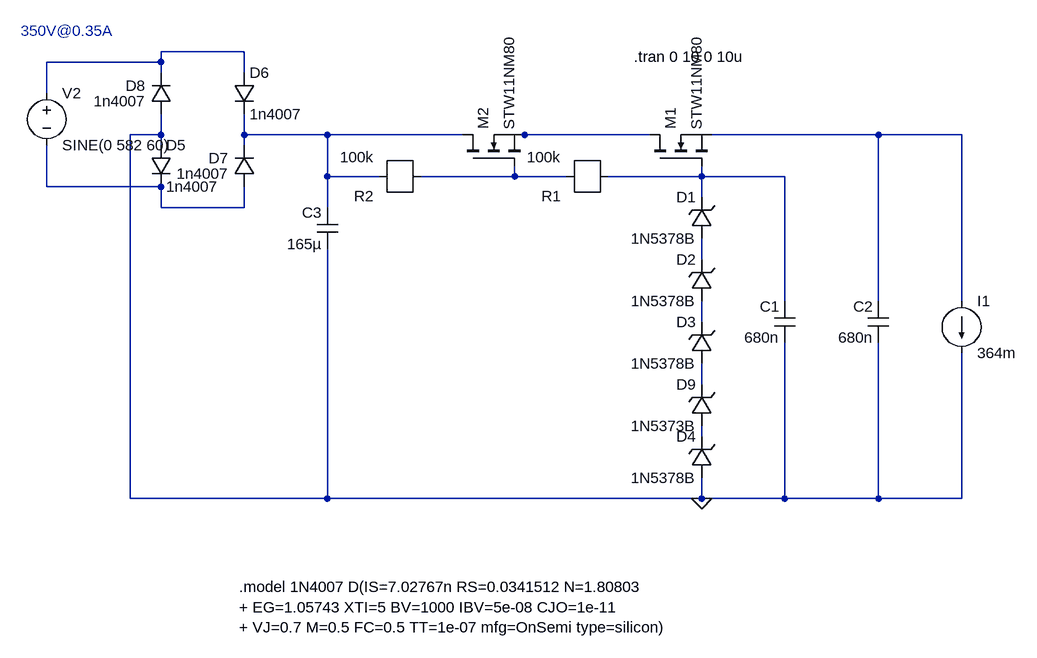
[diagram p0: schematic amp_TCC_fontes_430V_V2.0.asc]
amp_TCC_fontes_430V_V2.0.asc, the LTspice schematic file:
Version 4
SHEET 1 880 964
WIRE -416 80 -544 80
WIRE -544 96 -544 80
WIRE -544 96 -720 96
WIRE -544 112 -544 96
WIRE -416 112 -416 80
WIRE -720 144 -720 96
WIRE -544 208 -544 176
WIRE -544 208 -592 208
WIRE -416 208 -416 176
WIRE -288 208 -416 208
WIRE -80 208 -288 208
WIRE 16 208 0 208
WIRE 208 208 16 208
WIRE 560 208 304 208
WIRE 688 208 560 208
WIRE -544 224 -544 208
WIRE -416 224 -416 208
WIRE -288 272 -288 208
WIRE -208 272 -288 272
WIRE 0 272 0 256
WIRE 0 272 -144 272
WIRE 80 272 0 272
WIRE 288 272 288 256
WIRE 288 272 144 272
WIRE 416 272 288 272
WIRE -720 288 -720 224
WIRE -544 288 -720 288
WIRE 288 304 288 272
WIRE -544 320 -544 288
WIRE -416 320 -416 288
WIRE -416 320 -544 320
WIRE -288 320 -288 272
WIRE 288 400 288 368
WIRE 416 464 416 272
WIRE 560 464 560 208
WIRE 688 464 688 208
WIRE 288 496 288 464
WIRE 288 592 288 560
WIRE 288 672 288 656
WIRE -592 768 -592 208
WIRE -288 768 -288 384
WIRE -288 768 -592 768
WIRE 288 768 288 736
WIRE 288 768 -288 768
WIRE 416 768 416 528
WIRE 416 768 288 768
WIRE 560 768 560 528
WIRE 560 768 416 768
WIRE 688 768 688 544
WIRE 688 768 560 768
FLAG 288 768 0
SYMBOL nmos 208 256 R270
SYMATTR InstName M1
SYMATTR Value STW11NM80
SYMBOL zener 304 464 R180
WINDOW 0 24 64 Left 2
WINDOW 3 24 0 Left 2
SYMATTR InstName D2
SYMATTR Value 1N5378B
SYMBOL zener 304 368 R180
WINDOW 0 24 64 Left 2
WINDOW 3 24 0 Left 2
SYMATTR InstName D1
SYMATTR Value 1N5378B
SYMBOL zener 304 560 R180
WINDOW 0 24 64 Left 2
WINDOW 3 24 0 Left 2
SYMATTR InstName D3
SYMATTR Value 1N5378B
SYMBOL zener 304 736 R180
WINDOW 0 24 64 Left 2
WINDOW 3 24 0 Left 2
SYMATTR InstName D4
SYMATTR Value 1N5378B
SYMBOL r 144 272 R180
SYMATTR InstName R1
SYMATTR Value 100k
SYMBOL cap 432 528 R180
WINDOW 0 24 56 Left 2
WINDOW 3 24 8 Left 2
SYMATTR InstName C1
SYMATTR Value 680n
SYMBOL cap 576 528 R180
WINDOW 0 24 56 Left 2
WINDOW 3 24 8 Left 2
SYMATTR InstName C2
SYMATTR Value 680n
SYMBOL current 688 464 R0
SYMATTR InstName I1
SYMATTR Value 364m
SYMBOL cap -272 384 R180
WINDOW 0 24 56 Left 2
WINDOW 3 24 8 Left 2
SYMATTR InstName C3
SYMATTR Value 165µ
SYMATTR SpiceLine Rser=660m
SYMBOL voltage -720 128 R0
SYMATTR InstName V2
SYMATTR Value SINE(0 582 60)
SYMATTR SpiceLine Rser=49.705
SYMBOL diode -560 224 R0
SYMATTR InstName D5
SYMATTR Value 1n4007
SYMBOL diode -432 112 R0
SYMATTR InstName D6
SYMATTR Value 1n4007
SYMBOL diode -400 288 R180
WINDOW 0 40 44 Left 2
WINDOW 3 39 20 Left 2
SYMATTR InstName D7
SYMATTR Value 1n4007
SYMBOL diode -528 176 R180
WINDOW 0 40 44 Left 2
WINDOW 3 39 20 Left 2
SYMATTR InstName D8
SYMATTR Value 1n4007
SYMBOL zener 304 656 R180
WINDOW 0 24 64 Left 2
WINDOW 3 24 0 Left 2
SYMATTR InstName D9
SYMATTR Value 1N5373B
SYMBOL nmos -80 256 R270
SYMATTR InstName M2
SYMATTR Value STW11NM80
SYMBOL r -144 272 R180
SYMATTR InstName R2
SYMATTR Value 100k
TEXT 184 88 Left 2 !.tran 0 10 0 10u
TEXT -760 48 Left 2 ;350V@0.35A
TEXT -424 904 Left 2 !.model 1N4007 D(IS=7.02767n RS=0.0341512 N=1.80803 \n+ EG=1.05743 XTI=5 BV=1000 IBV=5e-08 CJO=1e-11 \n+ VJ=0.7 M=0.5 FC=0.5 TT=1e-07 mfg=OnSemi type=silicon)

The netlist it stands for:
* amp_TCC_fontes_430V_V2.0.asc
M1 N003 N006 N004 N004 STW11NM80
D2 N009 N008 1N5378B
D1 N008 N006 1N5378B
D3 N010 N009 1N5378B
D4 0 N011 1N5378B
R1 N005 N006 100k
C1 0 N006 680n
C2 0 N004 680n
I1 N004 0 364m
C3 0 N002 165µ Rser=660m
V2 N001 N007 SINE(0 582 60) Rser=49.705
D5 0 N007 1n4007
D6 N001 N002 1n4007
D7 N007 N002 1n4007
D8 0 N001 1n4007
D9 N011 N010 1N5373B
M2 N002 N005 N003 N003 STW11NM80
R2 N002 N005 100k
.model D D
.lib standard.dio
.model NMOS NMOS
.model PMOS PMOS
.lib standard.mos
.tran 0 10 0 10u
* 350V@0.35A
.model 1N4007 D(IS=7.02767n RS=0.0341512 N=1.80803
+ EG=1.05743 XTI=5 BV=1000 IBV=5e-08 CJO=1e-11
+ VJ=0.7 M=0.5 FC=0.5 TT=1e-07 mfg=OnSemi type=silicon)
.backanno
.end